# EAGLE design UI (EAGLE 9.4.0)
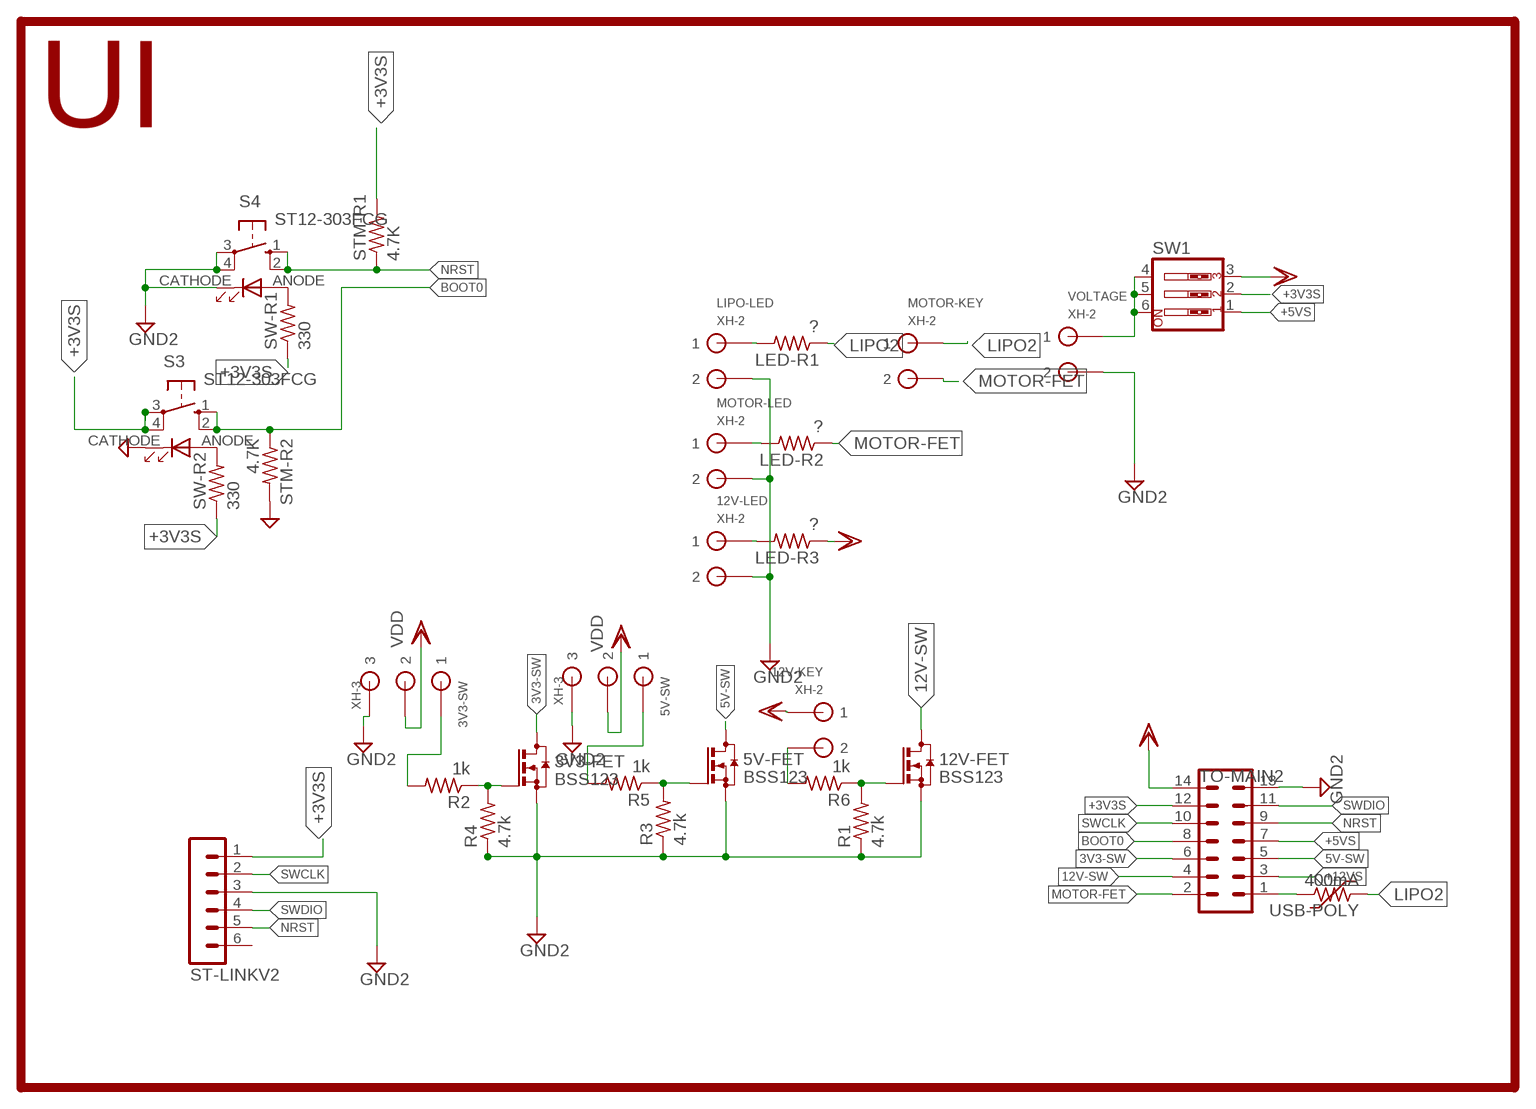
[diagram p0: schematic, sheet 1]

## Parts
3V3-FET  BSS123  [SOT23]
3V3-SW  XH-3  [CON3]
5V-FET  BSS123  [SOT23]
5V-SW  XH-3  [CON3]
12V-FET  BSS123  [SOT23]
12V-KEY  XH-2  [CON2]
12V-LED  XH-2  [CON2]
LED-R1  ?  R-US_M0805  [M0805]
LED-R2  ?  R-US_M0805  [M0805]
LED-R3  ?  R-US_M0805  [M0805]
LIPO-LED  XH-2  [CON2]
MOTOR-KEY  XH-2  [CON2]
MOTOR-LED  XH-2  [CON2]
R1  4.7k  R-US_M0805  [M0805]
R2  1k  R-US_M0805  [M0805]
R3  4.7k  R-US_M0805  [M0805]
R4  4.7k  R-US_M0805  [M0805]
R5  1k  R-US_M0805  [M0805]
R6  1k  R-US_M0805  [M0805]
S3  ST12-303FCG  [ST12303FCG]
S4  ST12-303FCG  [ST12303FCG]
ST-LINKV2  MA06-1  [MA06-1]
STM-R1  4.7K  R-US_R0805  [R0805]
STM-R2  4.7K  R-US_R0805  [R0805]
SW1  SW_DIP-3  [EDG-03]
SW-R1  330  R-US_R0805  [R0805]
SW-R2  330  R-US_R0805  [R0805]
TO-MAIN2  ML14  [ML14]
USB-POLY  400mA  PTC-MF-5,1  [MF-5/1]
VOLTAGE  XH-2  [CON2]

## Nets
3V3-SW: 3V3-FET.3(D) TO-MAIN2.6
5V-SW: 5V-FET.3(D) TO-MAIN2.5
12V-SW: 12V-FET.3(D) TO-MAIN2.4
+3V3S: S3.3 S3.4 ST-LINKV2.1 STM-R1.2 SW1.2 SW-R1.1 SW-R2.1 TO-MAIN2.12
+5VS: SW1.1 TO-MAIN2.7
+12VS: TO-MAIN2.3
BOOT0: S3.1 S3.2 STM-R2.1 TO-MAIN2.8
GND2: 3V3-FET.2(S) 3V3-SW.P$3 5V-FET.2(S) 5V-SW.P$3 12V-FET.2(S) 12V-LED.P$2 LIPO-LED.P$2 MOTOR-LED.P$2 R1.1 R3.1 R4.1 S3.CATHODE(C) S4.3 S4.4 S4.CATHODE(C) ST-LINKV2.3 STM-R2.2 TO-MAIN2.13 VOLTAGE.P$2
LIPO2: LED-R1.1 MOTOR-KEY.P$1 USB-POLY.1
MOTOR-FET: LED-R2.1 MOTOR-KEY.P$2 TO-MAIN2.2
N$2: 3V3-FET.1(G) R2.1 R4.2
N$3: 5V-FET.1(G) R3.2 R5.1
N$6: SW1.4 SW1.5 SW1.6 VOLTAGE.P$1
N$7: 12V-FET.1(G) R1.2 R6.1
N$8: 12V-KEY.P$2 R6.2
N$9: 3V3-SW.P$1 R2.2
N$10: 5V-SW.P$1 R5.2
N$11: S4.ANODE(A) SW-R1.2
N$12: S3.ANODE(A) SW-R2.2
N$13: TO-MAIN2.1 USB-POLY.2
N$14: LED-R1.2 LIPO-LED.P$1
N$15: LED-R2.2 MOTOR-LED.P$1
N$16: 12V-LED.P$1 LED-R3.2
NRST: S4.1 S4.2 ST-LINKV2.5 STM-R1.1 TO-MAIN2.9
SWCLK: ST-LINKV2.2 TO-MAIN2.10
SWDIO: ST-LINKV2.4 TO-MAIN2.11
VDD: 3V3-SW.P$2 5V-SW.P$2 12V-KEY.P$1 LED-R3.1 SW1.3 TO-MAIN2.14
Unconnected: ST-LINKV2.6

## Notes on the sheet
- UI

## Library data of the parts
3V3-FET 5V-FET 12V-FET = transistor-small-signal:BSS123: N-CHANNEL MOS FET
3V3-SW 5V-SW = 0@Mylibrary-main1:XH-3: low insertion CON
12V-KEY 12V-LED LIPO-LED MOTOR-KEY MOTOR-LED VOLTAGE = 0@Mylibrary-main1:XH-2: low insertion CON
LED-R1-LED-R3 R1-R6 = resistor:R-US_: RESISTOR, American symbol
S3 S4 = ST12-303FCG:ST12-303FCG: Pushbutton Switch Source: Datasheet <http://akizukidenshi.com/download/ST-12-303FC-G_SPEC.pdf>; DESCRIPTION: Pushbutton Switch; HEIGHT: 8mm; MANUFACTURER_NAME: Switronic; MANUFACTURER_PART_NUMBER: ST12-303FCG
ST-LINKV2 = 0con-lstb:MA06-1: PIN HEADER; OC_FARNELL: unknown; OC_NEWARK: unknown
STM-R1 STM-R2 SW-R1 SW-R2 = 0@Mylibrary-main1:R-US_: RESISTOR, American symbol
SW1 = 0special:SW_DIP-3: DIP SWITCH
TO-MAIN2 = 0con-harting-ml:ML14: HARTING; OC_FARNELL: unknown; OC_NEWARK: unknown
USB-POLY = polyswitch:PTC-: POLYSWITCH Polyswitch Resetable Fuses

## Board
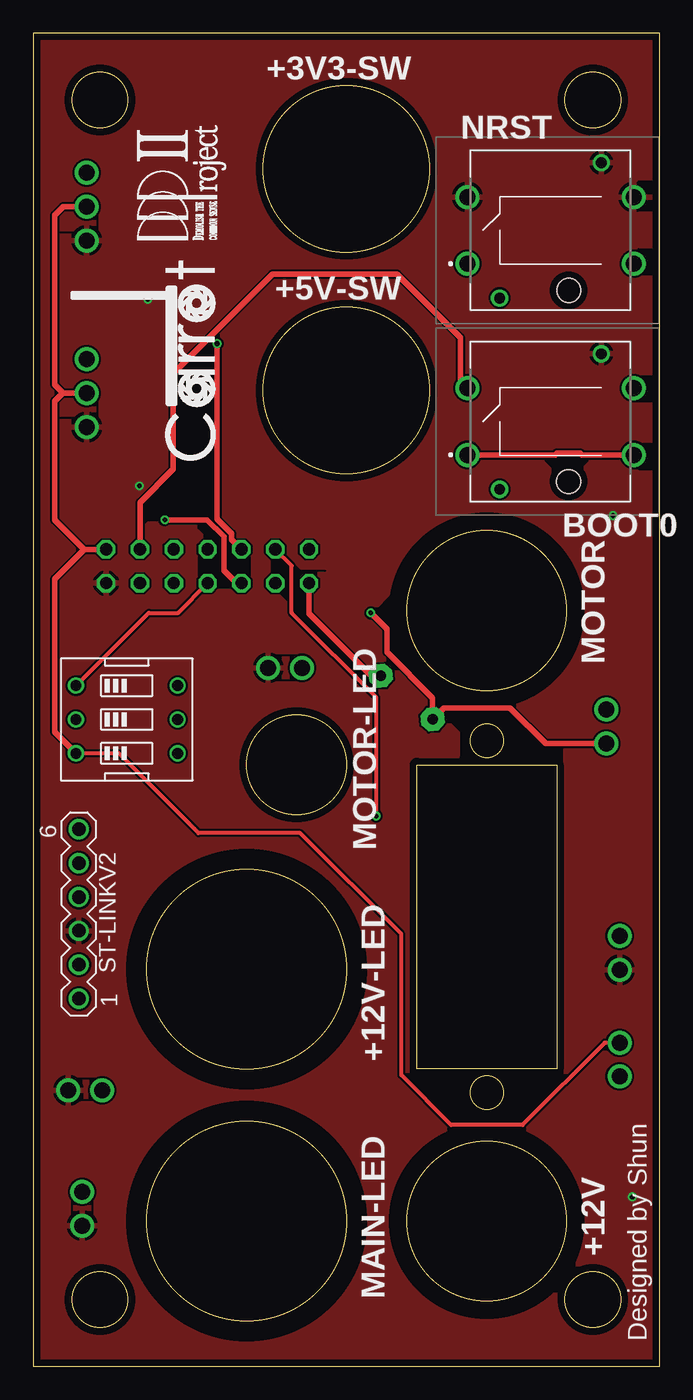
[diagram p1: board, top side]
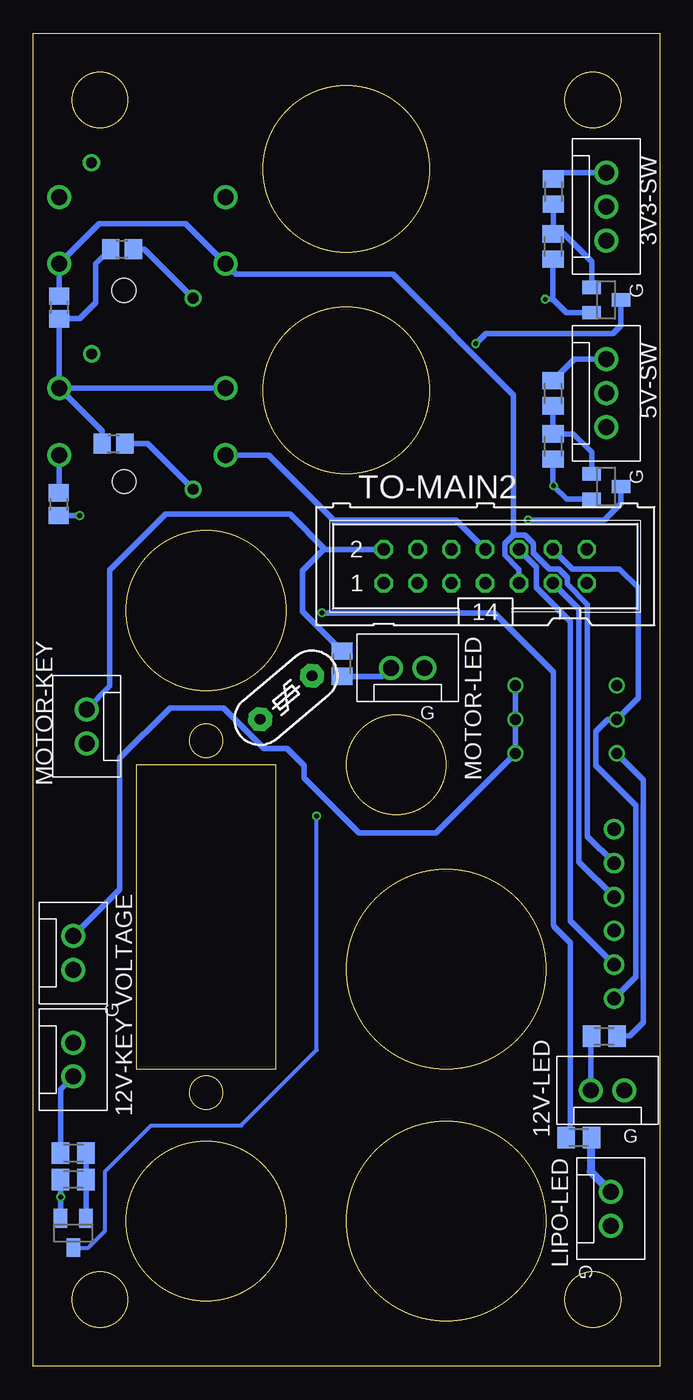
[diagram p2: board, bottom side, seen from below]

Size 47 x 100 mm. Coordinates in mm from the lower left corner, seen from the top.
Outline: 28.78,22.32 28.78,45.12 39.28,45.12 39.28,22.32 28.78,22.32
Outline: 0,0 47,0 47,100 0,100 0,0
Outline: circle at 16.01,29.78 radius 7.5
Outline: circle at 34.03,20.52 radius 1.25
Outline: circle at 16.01,10.89 radius 7.5
Outline: circle at 42,5 radius 2.1
Outline: circle at 34.03,10.89 radius 6
Outline: circle at 5,5 radius 2.1
Outline: circle at 23.5,73.21 radius 6.25
Outline: circle at 23.5,89.84 radius 6.25
Outline: circle at 42,95 radius 2.1
Outline: circle at 5,95 radius 2.1
Outline: circle at 34.03,56.7 radius 6
Outline: circle at 34.03,46.92 radius 1.25
Outline: circle at 19.76,45.12 radius 3.75
Copper layers (1*16): Top 0.035mm / dielectric 1.6mm / Bottom 0.035mm
Design rules "Elecrow_2-layer_PCB_eagle_rule": minimum track width 6mil, minimum drill 12mil, track to track 6mil, track to pad 6mil, pad to pad 6mil, via to via 8mil, smd to smd 0mil, copper to edge 20mil, drill to drill 10mil, minimum pad ring 6mil, minimum via ring 6mil, stop-mask expansion 0mil, vias tented up to drill 100mil, thermal gap 10mil
tRestrict: area 7,1.9 to 25,19.9; area 26.7,3.6 to 41.3,18.2; area 7,20.8 to 25,38.8; area 26.7,49.4 to 41.3,64; 40 lines

### Footprints (pad centres in the part's own frame; a part is rotated, then mirrored left to right if it is on the bottom)
SOT23 = smd 1 x 1.4: 1 -0.95,-1.1; 2 0.95,-1.1; 3 0,1.1
CON3 = drill 1.2: P$1 -2.54,0; P$2 0,0; P$3 2.54,0
CON2 = drill 1.2: P$1 -1.27,0; P$2 1.27,0
M0805 = smd 1.3 x 1.6: 1 -0.95,0; 2 0.95,0
ST12303FCG = drill 1.2 pad 1.8: 1 -6.25,-2.5; 2 6.25,-2.5; 3 -6.25,2.5; 4 6.25,2.5 | drill 0.8 pad 1.3: ANODE -3.81,-5.08; CATHODE 3.81,5.08 | hole 1.8: 1.37,-4.5
MA06-1 = drill 1.016: 1 -6.35,0; 2 -3.81,0; 3 -1.27,0; 4 1.27,0; 5 3.81,0; 6 6.35,0
R0805 = smd 1.3 x 1.5: 1 -0.85,0; 2 0.85,0
EDG-03 = drill 0.813: 1 -2.54,-3.81; 2 0,-3.81; 3 2.54,-3.81; 4 2.54,3.81; 5 0,3.81; 6 -2.54,3.81
ML14 = drill 0.914 octagon: 1 -7.62,-1.27; 2 -7.62,1.27; 3 -5.08,-1.27; 4 -5.08,1.27; 5 -2.54,-1.27; 6 -2.54,1.27; 7 0,-1.27; 8 0,1.27; 9 2.54,-1.27; 10 2.54,1.27; 11 5.08,-1.27; 12 5.08,1.27; 13 7.62,-1.27; 14 7.62,1.27
MF-5/1 = drill 0.813 pad 1.778 octagon: 1 -2.54,0; 2 2.54,0

### Placement (x,y rotation side)
3V3-FET  4,80 270 bottom
3V3-SW  4,87 270 bottom
5V-FET  4,66 270 bottom
5V-SW  4,73 270 bottom
12V-FET  44,10 180 bottom
12V-KEY  44,23 270 bottom
12V-LED  3.9,20.7 0 bottom
LED-R1  6.05,17.14 0 bottom
LED-R2  23.83,52.7 270 bottom
LED-R3  4.15,24.77 180 bottom
LIPO-LED  3.66,11.81 270 bottom
MOTOR-KEY  43,48 90 bottom
MOTOR-LED  18.9,52.4 0 bottom
R1  44,14 0 bottom
R2  7.97,88.13 90 bottom
R3  8,69 90 bottom
R4  8,84 90 bottom
R5  8,73 90 bottom
R6  44,16 180 bottom
S3  38.81,70.88 0 top
S4  38.82,85.22 0 top
ST-LINKV2  3.41,33.93 90 top
STM-R1  45.06,79.44 270 bottom
STM-R2  45.1,64.67 270 bottom
SW1  7.01,48.52 270 top
SW-R1  40.34,83.82 0 bottom
SW-R2  40.98,69.22 0 bottom
TO-MAIN2  13.08,60.02 0 bottom
U$7  [CARROT-SILK]  13.68,67.94 90 top
U$8  [DDPROJECT2]  16.21,83.82 90 top
USB-POLY  28.03,50.16 40 bottom
VOLTAGE  44,31 270 bottom

### Tracks (layer width: path | path; a pad name or v marks a point on that pad's centre or on a via)
3V3-SW  (via drill 0.35)
  Top 0.406: TO-MAIN2.6 14.87,62.04 14.87,62.46 13.79,63.54 v13.79,76.72
  Bottom 0.406: 3V3-FET.3 2.9,78.08 3.52,77.47 13.04,77.47 v13.79,76.72
5V-SW  (via drill 0.35)
  Top 0.406: v9.87,63.5 13.04,63.5 14.31,62.23 14.31,59.69 15.26,58.74 TO-MAIN2.5
  Bottom 0.406: 5V-FET.3 2.9,64.79 2.88,64.77 4.15,63.5 v9.87,63.5
12V-SW  (via drill 0.35)
  Top 0.305: v25.74,41.27 25.74,50.16 19.39,56.52 19.39,60.05 TO-MAIN2.4
  Bottom 0.305: 12V-FET.3 42.88,8.9 41.61,10.16 41.61,14.61 38.16,18.06 31.39,18.06 25.74,23.71 v25.74,41.27
+3V3S
  Top 0.406: TO-MAIN2.12 8,64.81 10.5,67.31 10.5,74.47 17.95,81.92 27.3,81.92 32.05,77.17 32.05,73.89 S3.3
  Bottom 0.406: ST-LINKV2.1 1.78,29.21 1.78,42.08 4.79,45.09 4.79,47.62 3.89,48.52 SW1.2 1.61,50.12 1.61,58.42 3,59.81 6.53,59.81 TO-MAIN2.12 | SW-R1.1 42.31,82.7 42.31,79.8 43.52,78.59 STM-R1.2 S3.4 | S3.3 S3.4 | S3.4 41.83,70.14 SW-R2.1
+5VS
  Top 0.305: SW1.1 8.66,56.52 10.85,56.52 TO-MAIN2.7
BOOT0
  Top 0.406: S3.1 39.19,68.38 39.31,68.49 41.06,68.49 41.18,68.38 S3.2
  Bottom 0.406: STM-R2.1 45.06,65.55 S3.2 | TO-MAIN2.8 15.29,63.5 24.47,63.5 29.34,68.38 S3.1
GND2  (via drill 0.35)
  Bottom 0.406: STM-R2.2 v43.52,63.81 | 3V3-FET.2 7,79.05 8,80.05 | R4.1 8,80.05 | 8,80.05 v8.6,80.05 | 5V-FET.2 6.97,65.05 v7.96,66.04 8,66.08 R3.1 | R1.1 v44.95,12.7 12V-FET.2
  pour Top: -0.04,99.69 47.33,99.69 47.33,0 -0.04,0
LIPO2  (via drill 0.35)
  Top 0.406: MOTOR-KEY.P$1 38.45,46.73 35.79,49.39 30.83,49.39 USB-POLY.1 29.97,50.14 26.53,53.59 26.53,55.32 v25.33,56.52
  Bottom 0.406: LED-R1.1 6.69,17.46 6.69,31.75 7.88,32.94 7.92,33.04 7.96,33.16 7.96,52.07 12.4,56.52 v25.33,56.52
MOTOR-FET
  Bottom 0.406: 25.1,61.28 25.22,61.28 26.81,59.69 26.81,56.63 LED-R2.1 | 25.1,61.28 TO-MAIN2.2 | MOTOR-KEY.P$2 41.25,51.02 41.25,59.73 37.06,63.91 27.73,63.91 25.1,61.28
N$2
  Bottom 0.406: R2.1 7.97,84.98 R4.2 7.19,84.95 5.1,82.86 3V3-FET.1
N$3
  Bottom 0.406: R5.1 R3.2 6.47,69.95 5.1,68.58 5V-FET.1
N$6
  Bottom 0.406: SW1.6 SW1.5 SW1.4 16.8,40.01 22.56,40.01 26.69,44.13 26.69,45.09 27.96,46.35 29.69,46.35 32.73,49.39 36.74,49.39 40.5,45.63 40.5,35.77 VOLTAGE.P$1
N$7
  Bottom 0.406: R6.1 R1.2 12V-FET.1
N$8
  Bottom 0.406: R6.2 44.95,20.78 12V-KEY.P$2
N$9
  Bottom 0.406: 3V3-SW.P$1 7.51,89.54 R2.2
N$10
  Bottom 0.406: 5V-SW.P$1 6.41,75.54 R5.2
N$11
  Bottom 0.406: S4.ANODE 38.69,83.82 SW-R1.2
N$12
  Bottom 0.406: S3.ANODE 38.42,69.22 SW-R2.2
N$13
  Top 0.406: TO-MAIN2.1 20.7,56.48 25.38,51.8 USB-POLY.2
N$14
  Bottom 0.406: LED-R1.2 5.17,17.08
  Bottom 0.61: 5.17,17.08 5.17,14.6 LIPO-LED.P$1
N$15
  Bottom 0.406: LED-R2.2 20.81,51.76 MOTOR-LED.P$1
N$16
  Bottom 0.406: LED-R3.2 5.17,24.7 12V-LED.P$1
NRST
  Bottom 0.406: 10.98,62.35 10.1,62.35 9.47,61.73 9.47,61.01 8.28,59.81 7.56,59.81 6.93,59.19 6.93,58.66 5.42,57.15 5.42,39.75 ST-LINKV2.5 | 10.98,62.35 11.61,61.73 11.61,60.84 10.54,59.78 TO-MAIN2.9 | 10.98,62.35 10.98,72.87 20.02,81.92 31.77,81.92 S4.1 35.58,85.72 42.06,85.72 S4.2 45.06,82.71 STM-R1.1
SWCLK
  Bottom 0.406: ST-LINKV2.2 6.69,33.4 6.69,55.88 9.23,58.42 9.23,59.98 TO-MAIN2.10
SWDIO
  Bottom 0.406: ST-LINKV2.4 6.05,37.84 6.05,56.8 TO-MAIN2.11
VDD
  Top 0.305: 12V-KEY.P$1 42.88,24.27 36.72,18.11 31.35,18.11 27.61,21.84 27.61,32.42 20.02,40.01 12.4,40.01 6.43,45.98 SW1.3
  Top 0.406: 2.25,73 5V-SW.P$2 | 3V3-SW.P$2 2.25,87 1.61,86.36 1.61,73.64 2.25,73 | TO-MAIN2.14 3.83,61.28 | 3.83,61.28 1.61,63.5 1.61,72.39 2.22,73 2.25,73 | SW1.3 1.61,47.58 1.61,59.07 3.83,61.28
  Bottom 0.406: SW1.3 1.22,43.99 1.22,25.79 2.25,24.77 LED-R3.1

### Text on the board
tPlace: +3V3-SW | NRST | +5V-SW | BOOT0 | MOTOR | MOTOR-LED | +12V-LED | +12V | MAIN-LED | Designed by Shun
bPlace: G | G | G | G | G | G